# Altium schematic sheet Netscale48HD_Power_Supply.SchDoc: Power Supply
size A3; CompanyName: Reichle & De-Massari; Organization: Reichle & De-Massari; Address1: Binzstrasse 32; Address2: 8620 Wetzikon; Address3: Switzerland; Revision: V0.2; SheetNumber: 5; SheetTotal: 5
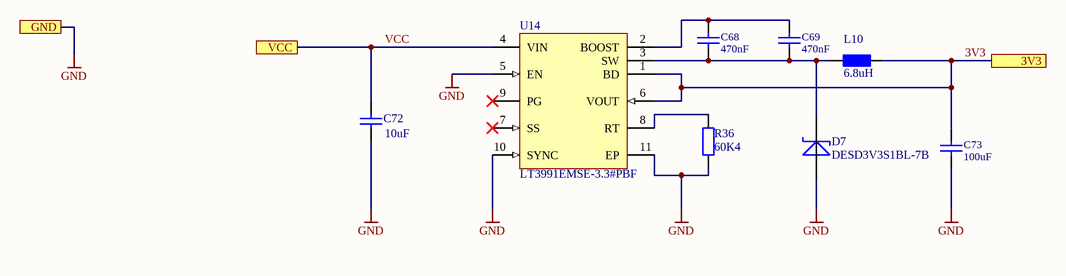
[diagram p0: Netscale48HD_Power_Supply.SchDoc]

## Parts
C68  470nF  [CAP-0805[2012] - RFL]
C69  470nF  [CAP-0805[2012] - RFL]
C72  value 10uF  [CAPC5750X279X64LL40T39]  (hidden comment: 22201C106MAT2A)
C73  100uF  [CAP-1210[3225] - RFL]
D7  DESD3V3S1BL-7B  [DFN1006-2]
L10  ShortDescription: 6.8uH  [Würth_Special Murata LQH5BPN_2_R]  (hidden comment: 78438357068)
R36  60K4  [RES-0402[1005] - RFL]
U14  LT3991EMSE-3.3#PBF  [Linear_10-Lead Plastic MSOP_11_R]

## Ports
3V3, GND, VCC

## Nets
GND: C72.1 C73.2(Neg) D7.2(A) R36.2 U14.5(EN) U14.10(SYNC) U14.11(EP) ; port GND
3V3: C73.1(Pos) L10.2 U14.1(BD) U14.6(VOUT) ; port 3V3
VCC: C72.2 U14.4(VIN) ; port VCC
NetC68_1: C68.1(Pos) C69.1(Pos) U14.2(BOOST)
NetC68_2: C68.2(Neg) C69.2(Neg) D7.1(K) L10.1 U14.3(SW)
NetR36_1: R36.1 U14.8(RT)

Not connected (* = marked no-connect by the designer): U14 7(SS)* 9(PG)*

## Notes on the sheet
- Title
- Size:
- Date:
- A3
- Number:
- Time:
- Revision:
- Sheet
- of
- File:

## Library data of the parts
C68 C69 = Cap_470nF_0805_100V: 470nF, 100V, X7R, 10 %, Chip Monolithic Ceramic Capacitor for General, 0805 (metric 2012); Manufacturer: Murata; Manufacturer PartNr: GRM21BR72A474KA73L; voltage: 100 VDC; Replaceable: yes; tolerance: 10 %; value: 470nF; ShortDescription: 470nF, 100V; Supplier 1: Mouser; Supplier Part Number 1: 81-GRM21BR72A474KA73; Dielectric Grade: X7R; Footprint/Package: 0805
C72 = CMP-2000-07534-1: Chip Capacitor, 10 uF, +/- 20%, 100 V, -55 to 125 degC, 2220 (5750 Metric), RoHS, Tape and Reel; Manufacturer: AVX; Datasheet URL: http://datasheets.avx.com/X7RDielectric.pdf; Package Reference: 2220; Package Description: 2-Pin Surface Mount Device, Body 5 x 5.7 mm; Datasheet Version: 03/2017; Manufacturer URL: http://www.avx.com/; Mounting Technology: SurfaceMount
C73 = Cap_100uF_10V_1210: Multilayer Ceramic Capacitors MLCC - SMD/SMT 1210 100uF 10volts *Derate Voltage/Temp; Manufacturer: Murata; Manufacturer PartNr: GRM32ER61A107ME20L; ShortDescription: 100uF, 10V; Dielectric Grade: X5R; Replaceable: yes; voltage: 10 V; value: 100uF; Footprint/Package: 1210; Supplier 1: Mouser; Supplier Part Number 1: 81-GRM32ER61A107ME0L
D7 = SCHOTTKY-DIODE-1K-2A: 15MQ060N SCHOTTKY RECTIFIER; Manufacturer: SMC; Manufacturer PartNr: 15MQ060N; ShortDescription: 15MQ060N
L10 = SMD power Inductor: 6.8uH, WE-MAIA SMD Power Inductor; Manufacturer: Würth; Manufacturer PartNr: 78438357068
R36 = PassResBas0402-00711-A.3: 60.4 kOhms ±1% 0.063W, 1/16W Chip Resistor 0402 (1005 Metric) Moisture Resistant Thick Film; Manufacturer: Yageo; Manufacturer PartNr: RC0402FR-0760K4L; value: 60K4; tolerance: 1%; Supplier 1: Digi-Key; power: 0.063W; Supplier Part Nummber 1: RC0402FR-0760K4L
U14 = Linear_LT3991-3.3_10-Lead Plastic MSOP_11: 55V, 1.2A Step-Down Regulator with 2.8μA Quiescent Current; Manufacturer: Linear; Manufacturer PartNr: LT3991EMSE-3.3#PBF; ShortDescription: LT3991EMSE-3.3#PBF